# Altium schematic sheet power.SchDoc
size A4; DocumentNumber: 3; SheetNumber: 3; SheetTotal: 4
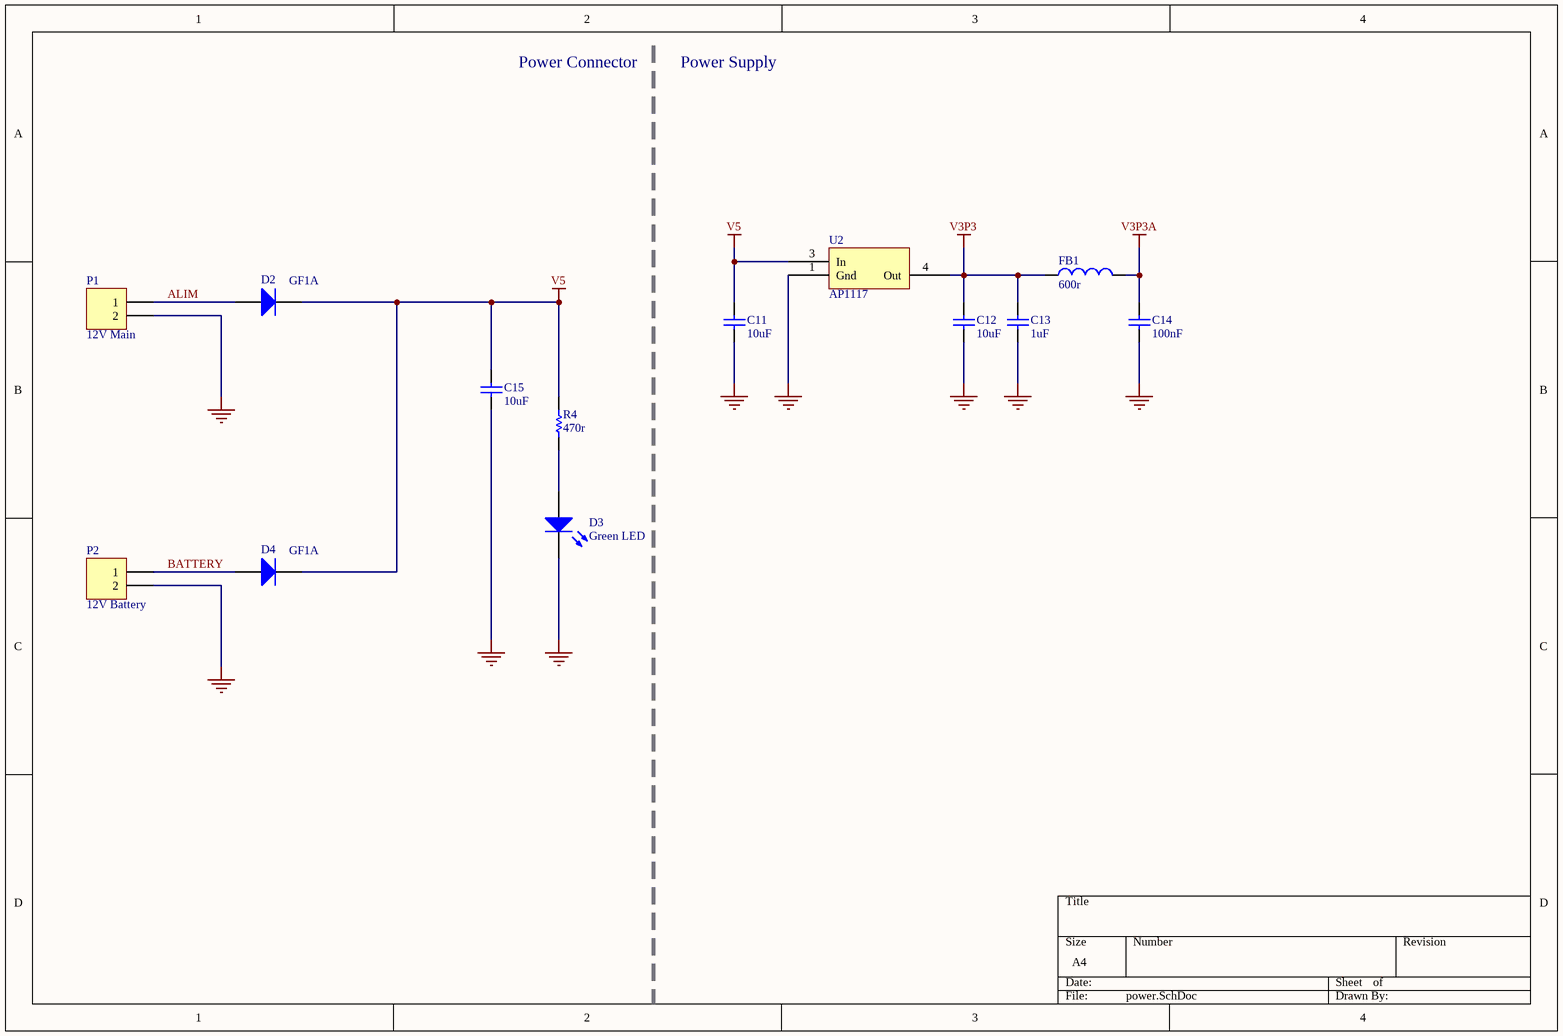
[diagram p0: power.SchDoc]

## Parts
C11  10uF  [CAPC2012N]
C12  10uF  [CAPC2012N]
C13  1uF  [CAPC2012N]
C14  100nF  [CAPC1608N]
C15  10uF  [CAPC1608N]
D2  GF1A  [SMA/DO-214AC_21]
D3  Green LED  [LED 0805]
D4  GF1A  [SMA/DO-214AC_21]
FB1  600r  [INDC1608AN]
P1  12V Main  [PHOENIX_1985195]
P2  12V Battery  [PHOENIX_1985195]
R4  470r  [RESC1608N]
U2  AP1117  [TD03B_N]

## Nets
GND: C11.1 C12.1 C13.1 C14.1 C15.1 D3.2(K) P1.2 P2.2 U2.1(Gnd)
V3P3: C12.2 C13.2 FB1.1 U2.4(Out)
V3P3A: C14.2 FB1.2
V5: C11.2 C15.2 D2.2(K) D4.2(K) R4.2 U2.3(In)
ALIM: D2.1(A) P1.1
BATTERY: D4.1(A) P2.1
NetD3_1: D3.1(A) R4.1

## Notes on the sheet
- Power Connector
- Power Supply

## Library data of the parts
C11-C15 = Cap: Capacitor; Fournisseur: Farnell; Published: 8-Jun-2000; LatestRevisionDate: 17-Jul-2002; LatestRevisionNote: Re-released for DXP Platform.; PackageReference: RAD-0.3; Publisher: Altium Limited; PackageDescription: Radial Cap, Thru-Hole; 2 Leads; 0.3 in Pin Spacing
  C11 C12 C15: Value: 10uF
  C13: Value: 1uF
  C14: Value: 100nF
D2 D4 = Diode: Default Diode; Fournisseur: Farnell; Published: 8-Jun-2000; LatestRevisionDate: 17-Jul-2002; LatestRevisionNote: Re-released for DXP Platform.; PackageVersion: Sep-1996; PackageReference: SMC; Publisher: Altium Limited; PackageDescription: DO-214-AB/SMC; 2 C-Bend Leads; Body 7.9 x 5.9 mm, inc. leads (LxW); Code_JEDEC: DO-214-AB
D3 = LED0: Typical INFRARED GaAs LED; Fournisseur: Farnell; Published: 8-Jun-2000; LatestRevisionDate: 08-Jul-2005; LatestRevisionNote: Mech Layer 1 removed.; PackageReference: LED-0; Publisher: Altium Limited; PackageDescription: LED; 2 Leads
FB1 = Inductor: Code_IEC: 1005; Fournisseur: Farnell; Published: 8-Jun-2000; LatestRevisionDate: 29-May-2009; LatestRevisionNote: IPC-7351 Footprint Added.; PackageReference: 0402-A; Publisher: Altium Limited; PackageDescription: Chip Inductor; Code_JEITA: 0402; Value: 600r
P1 P2 = Header 2: Header, 2-Pin; Fournisseur: Farnell; LatestRevisionDate: 17-Jul-2002; LatestRevisionNote: Re-released for DXP Platform.; Publisher: Altium Limited
R4 = Res1: Resistor; Fournisseur: Farnell; Published: 8-Jun-2000; LatestRevisionDate: 17-Jul-2002; LatestRevisionNote: Re-released for DXP Platform.; PackageReference: AXIAL-0.3; Publisher: Altium Limited; PackageDescription: Axial Device, Thru-Hole; 2 Leads; 0.3 in Pin Spacing; Value: 470r
U2 = AP1117: Fournisseur: Farnell